# Altium schematic sheet in3ator_LEDStrip2.SchDoc
size A3; SheetNumber: 1; SheetTotal: 1
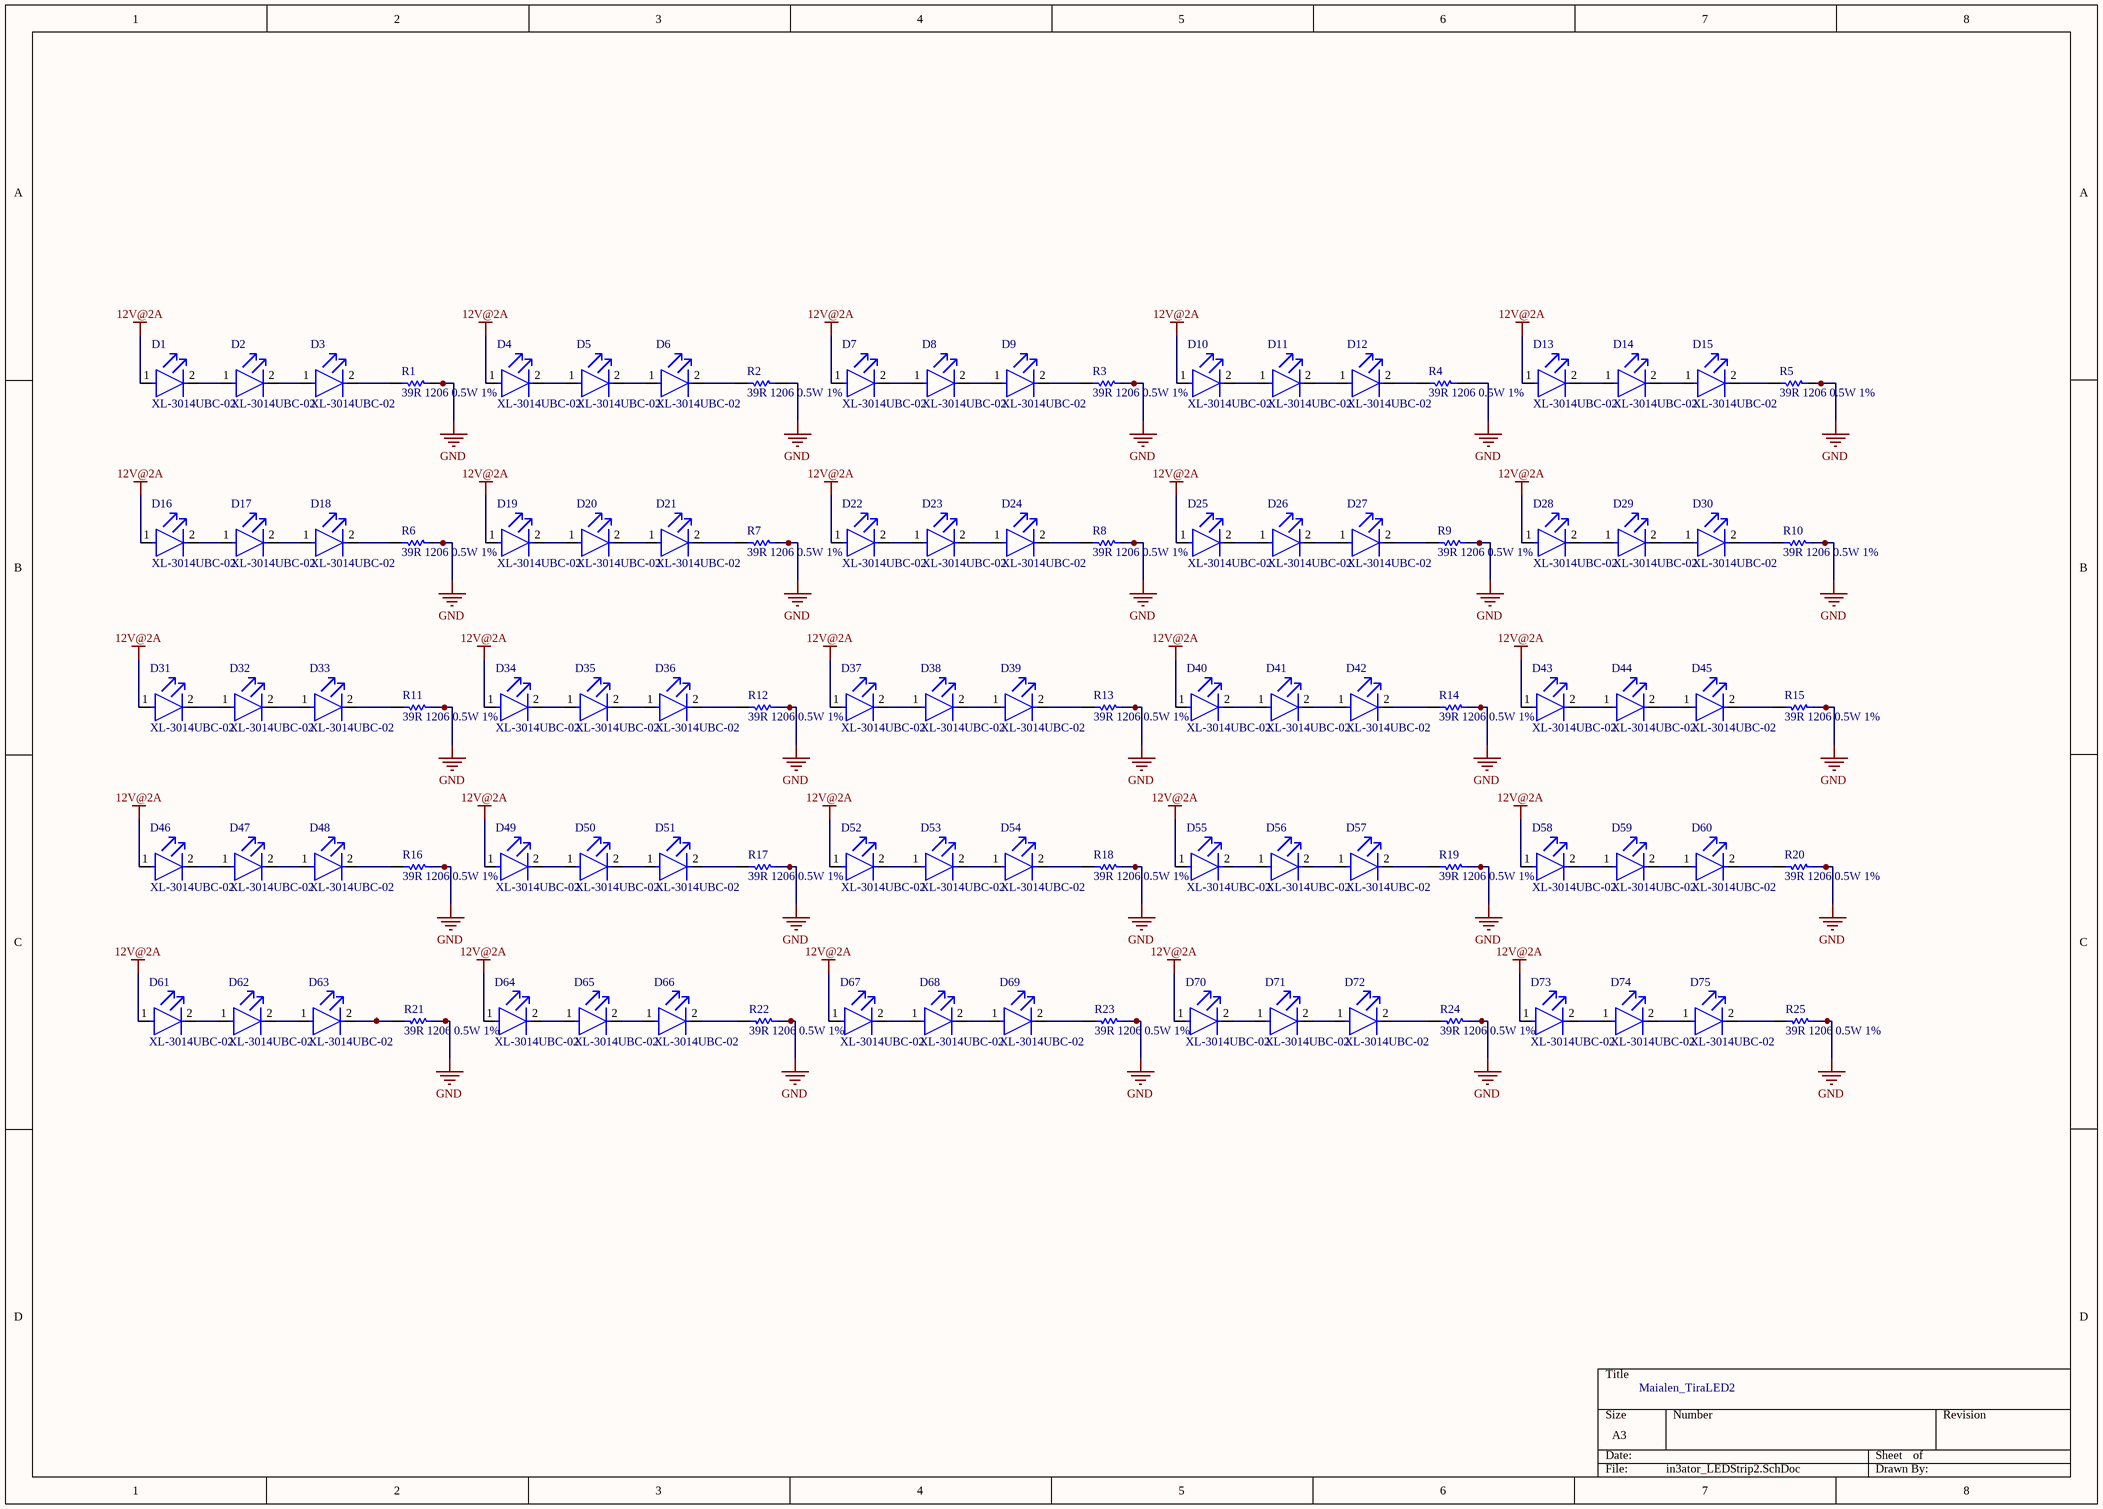
[diagram p0: in3ator_LEDStrip2.SchDoc]

## Parts
D1  XL-3014UBC-02  [Diode_led]
D2  XL-3014UBC-02  [Diode_led]
D3  XL-3014UBC-02  [Diode_led]
D4  XL-3014UBC-02  [Diode_led]
D5  XL-3014UBC-02  [Diode_led]
D6  XL-3014UBC-02  [Diode_led]
D7  XL-3014UBC-02  [Diode_led]
D8  XL-3014UBC-02  [Diode_led]
D9  XL-3014UBC-02  [Diode_led]
D10  XL-3014UBC-02  [Diode_led]
D11  XL-3014UBC-02  [Diode_led]
D12  XL-3014UBC-02  [Diode_led]
D13  XL-3014UBC-02  [Diode_led]
D14  XL-3014UBC-02  [Diode_led]
D15  XL-3014UBC-02  [Diode_led]
D16  XL-3014UBC-02  [Diode_led]
D17  XL-3014UBC-02  [Diode_led]
D18  XL-3014UBC-02  [Diode_led]
D19  XL-3014UBC-02  [Diode_led]
D20  XL-3014UBC-02  [Diode_led]
D21  XL-3014UBC-02  [Diode_led]
D22  XL-3014UBC-02  [Diode_led]
D23  XL-3014UBC-02  [Diode_led]
D24  XL-3014UBC-02  [Diode_led]
D25  XL-3014UBC-02  [Diode_led]
D26  XL-3014UBC-02  [Diode_led]
D27  XL-3014UBC-02  [Diode_led]
D28  XL-3014UBC-02  [Diode_led]
D29  XL-3014UBC-02  [Diode_led]
D30  XL-3014UBC-02  [Diode_led]
D31  XL-3014UBC-02  [Diode_led]
D32  XL-3014UBC-02  [Diode_led]
D33  XL-3014UBC-02  [Diode_led]
D34  XL-3014UBC-02  [Diode_led]
D35  XL-3014UBC-02  [Diode_led]
D36  XL-3014UBC-02  [Diode_led]
D37  XL-3014UBC-02  [Diode_led]
D38  XL-3014UBC-02  [Diode_led]
D39  XL-3014UBC-02  [Diode_led]
D40  XL-3014UBC-02  [Diode_led]
D41  XL-3014UBC-02  [Diode_led]
D42  XL-3014UBC-02  [Diode_led]
D43  XL-3014UBC-02  [Diode_led]
D44  XL-3014UBC-02  [Diode_led]
D45  XL-3014UBC-02  [Diode_led]
D46  XL-3014UBC-02  [Diode_led]
D47  XL-3014UBC-02  [Diode_led]
D48  XL-3014UBC-02  [Diode_led]
D49  XL-3014UBC-02  [Diode_led]
D50  XL-3014UBC-02  [Diode_led]
D51  XL-3014UBC-02  [Diode_led]
D52  XL-3014UBC-02  [Diode_led]
D53  XL-3014UBC-02  [Diode_led]
D54  XL-3014UBC-02  [Diode_led]
D55  XL-3014UBC-02  [Diode_led]
D56  XL-3014UBC-02  [Diode_led]
D57  XL-3014UBC-02  [Diode_led]
D58  XL-3014UBC-02  [Diode_led]
D59  XL-3014UBC-02  [Diode_led]
D60  XL-3014UBC-02  [Diode_led]
D61  XL-3014UBC-02  [Diode_led]
D62  XL-3014UBC-02  [Diode_led]
D63  XL-3014UBC-02  [Diode_led]
D64  XL-3014UBC-02  [Diode_led]
D65  XL-3014UBC-02  [Diode_led]
D66  XL-3014UBC-02  [Diode_led]
D67  XL-3014UBC-02  [Diode_led]
D68  XL-3014UBC-02  [Diode_led]
D69  XL-3014UBC-02  [Diode_led]
D70  XL-3014UBC-02  [Diode_led]
D71  XL-3014UBC-02  [Diode_led]
D72  XL-3014UBC-02  [Diode_led]
D73  XL-3014UBC-02  [Diode_led]
D74  XL-3014UBC-02  [Diode_led]
D75  XL-3014UBC-02  [Diode_led]
R1  39R 1206 0.5W 1%  [CAPC3216X180X55ML20T25]
R2  39R 1206 0.5W 1%  [CAPC3216X180X55ML20T25]
R3  39R 1206 0.5W 1%  [CAPC3216X180X55ML20T25]
R4  39R 1206 0.5W 1%  [CAPC3216X180X55ML20T25]
R5  39R 1206 0.5W 1%  [CAPC3216X180X55ML20T25]
R6  39R 1206 0.5W 1%  [CAPC3216X180X55ML20T25]
R7  39R 1206 0.5W 1%  [CAPC3216X180X55ML20T25]
R8  39R 1206 0.5W 1%  [CAPC3216X180X55ML20T25]
R9  39R 1206 0.5W 1%  [CAPC3216X180X55ML20T25]
R10  39R 1206 0.5W 1%  [CAPC3216X180X55ML20T25]
R11  39R 1206 0.5W 1%  [CAPC3216X180X55ML20T25]
R12  39R 1206 0.5W 1%  [CAPC3216X180X55ML20T25]
R13  39R 1206 0.5W 1%  [CAPC3216X180X55ML20T25]
R14  39R 1206 0.5W 1%  [CAPC3216X180X55ML20T25]
R15  39R 1206 0.5W 1%  [CAPC3216X180X55ML20T25]
R16  39R 1206 0.5W 1%  [CAPC3216X180X55ML20T25]
R17  39R 1206 0.5W 1%  [CAPC3216X180X55ML20T25]
R18  39R 1206 0.5W 1%  [CAPC3216X180X55ML20T25]
R19  39R 1206 0.5W 1%  [CAPC3216X180X55ML20T25]
R20  39R 1206 0.5W 1%  [CAPC3216X180X55ML20T25]
R21  39R 1206 0.5W 1%  [CAPC3216X180X55ML20T25]
R22  39R 1206 0.5W 1%  [CAPC3216X180X55ML20T25]
R23  39R 1206 0.5W 1%  [CAPC3216X180X55ML20T25]
R24  39R 1206 0.5W 1%  [CAPC3216X180X55ML20T25]
R25  39R 1206 0.5W 1%  [CAPC3216X180X55ML20T25]

## Nets
12V@2A: D1.1(A) D4.1(A) D7.1(A) D10.1(A) D13.1(A) D16.1(A) D19.1(A) D22.1(A) D25.1(A) D28.1(A) D31.1(A) D34.1(A) D37.1(A) D40.1(A) D43.1(A) D46.1(A) D49.1(A) D52.1(A) D55.1(A) D58.1(A) D61.1(A) D64.1(A) D67.1(A) D70.1(A) D73.1(A)
GND: R1.2 R2.2 R3.2 R4.2 R5.2 R6.2 R7.2 R8.2 R9.2 R10.2 R11.2 R12.2 R13.2 R14.2 R15.2 R16.2 R17.2 R18.2 R19.2 R20.2 R21.2 R22.2 R23.2 R24.2 R25.2
NetD1_2: D1.2(C) D2.1(A)
NetD2_2: D2.2(C) D3.1(A)
NetD3_2: D3.2(C) R1.1
NetD4_2: D4.2(C) D5.1(A)
NetD5_2: D5.2(C) D6.1(A)
NetD6_2: D6.2(C) R2.1
NetD7_2: D7.2(C) D8.1(A)
NetD8_2: D8.2(C) D9.1(A)
NetD9_2: D9.2(C) R3.1
NetD10_2: D10.2(C) D11.1(A)
NetD11_2: D11.2(C) D12.1(A)
NetD12_2: D12.2(C) R4.1
NetD13_2: D13.2(C) D14.1(A)
NetD14_2: D14.2(C) D15.1(A)
NetD15_2: D15.2(C) R5.1
NetD16_2: D16.2(C) D17.1(A)
NetD17_2: D17.2(C) D18.1(A)
NetD18_2: D18.2(C) R6.1
NetD19_2: D19.2(C) D20.1(A)
NetD20_2: D20.2(C) D21.1(A)
NetD21_2: D21.2(C) R7.1
NetD22_2: D22.2(C) D23.1(A)
NetD23_2: D23.2(C) D24.1(A)
NetD24_2: D24.2(C) R8.1
NetD25_2: D25.2(C) D26.1(A)
NetD26_2: D26.2(C) D27.1(A)
NetD27_2: D27.2(C) R9.1
NetD28_2: D28.2(C) D29.1(A)
NetD29_2: D29.2(C) D30.1(A)
NetD30_2: D30.2(C) R10.1
NetD31_2: D31.2(C) D32.1(A)
NetD32_2: D32.2(C) D33.1(A)
NetD33_2: D33.2(C) R11.1
NetD34_2: D34.2(C) D35.1(A)
NetD35_2: D35.2(C) D36.1(A)
NetD36_2: D36.2(C) R12.1
NetD37_2: D37.2(C) D38.1(A)
NetD38_2: D38.2(C) D39.1(A)
NetD39_2: D39.2(C) R13.1
NetD40_2: D40.2(C) D41.1(A)
NetD41_2: D41.2(C) D42.1(A)
NetD42_2: D42.2(C) R14.1
NetD43_2: D43.2(C) D44.1(A)
NetD44_2: D44.2(C) D45.1(A)
NetD45_2: D45.2(C) R15.1
NetD46_2: D46.2(C) D47.1(A)
NetD47_2: D47.2(C) D48.1(A)
NetD48_2: D48.2(C) R16.1
NetD49_2: D49.2(C) D50.1(A)
NetD50_2: D50.2(C) D51.1(A)
NetD51_2: D51.2(C) R17.1
NetD52_2: D52.2(C) D53.1(A)
NetD53_2: D53.2(C) D54.1(A)
NetD54_2: D54.2(C) R18.1
NetD55_2: D55.2(C) D56.1(A)
NetD56_2: D56.2(C) D57.1(A)
NetD57_2: D57.2(C) R19.1
NetD58_2: D58.2(C) D59.1(A)
NetD59_2: D59.2(C) D60.1(A)
NetD60_2: D60.2(C) R20.1
NetD61_2: D61.2(C) D62.1(A)
NetD62_2: D62.2(C) D63.1(A)
NetD63_2: D63.2(C) R21.1
NetD64_2: D64.2(C) D65.1(A)
NetD65_2: D65.2(C) D66.1(A)
NetD66_2: D66.2(C) R22.1
NetD67_2: D67.2(C) D68.1(A)
NetD68_2: D68.2(C) D69.1(A)
NetD69_2: D69.2(C) R23.1
NetD70_2: D70.2(C) D71.1(A)
NetD71_2: D71.2(C) D72.1(A)
NetD72_2: D72.2(C) R24.1
NetD73_2: D73.2(C) D74.1(A)
NetD74_2: D74.2(C) D75.1(A)
NetD75_2: D75.2(C) R25.1

## Notes on the sheet
- Maialen_TiraLED2

## Library data of the parts
D1-D75 = CMP-05535-000002-1: LED GREEN ESS II SMD; Obsolete Part: true; Manufacturer: Panasonic; Manufacturer Part Number: LNJ337W83RA; Peak Emmision Wavelength: 575nm; Wavelength: 572nm; Reverse Voltage: 4V; Forward Current: 5mA; Forward Voltage: 1.95V; Luminous Intensity: 7.5mcd; Led Orientation: Top View; Power Dissipation: 55mW; Automotive: No; Mouser Description: LNJ337W83RA; ESS II Series Yellow-Green LED; 572 nm 1608(0603); Rectangle Lens; Temperature: -30°C to +85°C; Category: Diode; Temperature Range High: +85°C; Colour: Green; Height: 0.25mm; Device Class L2: LEDs; Device Class L3: unset; ComponentLink2Description: Datasheet; RoHS: TRUE; Package: LNJ337W83RA; Digikey Description: LED GREEN ESS II SMD; Lead Free: Yes; Ambient Temperature Range High: +85°C; ComponentLink2URL: https://industrial.panasonic.com/content/data/SC/ds/ds4/LNJ337W83RA_E.pdf; Temperature Range Low: -30°C; Octopart: https://octopart.com/lnj337w83ra-panasonic-44404387; Ambient Temperature Range Low: -30°C; Device Class L1: Optoelectronics; LCSC_PN: C2843789
R1-R25 = CMP-0abdc173b10ad57a-1: Manufacturer Part Number: WSLP12065L000FEA; Resistance: 0,002; Power: 1W; Octopart URL: https://octopart.com/1-2176055-0-te+connectivity-46440145; Case/Package: 1206; Lifecycle Status: Not Listed by Manufacturer; Packaging: Tape & Reel (TR); OctopartID: 0abdc173b10ad57a; OrderingCode: WSLP12065L000FEA; Manufacturer Part Number 2: FMF06FTHR005-LHL; LCSC_PN: C137295